# EAGLE design board (EAGLE 6.5.0)
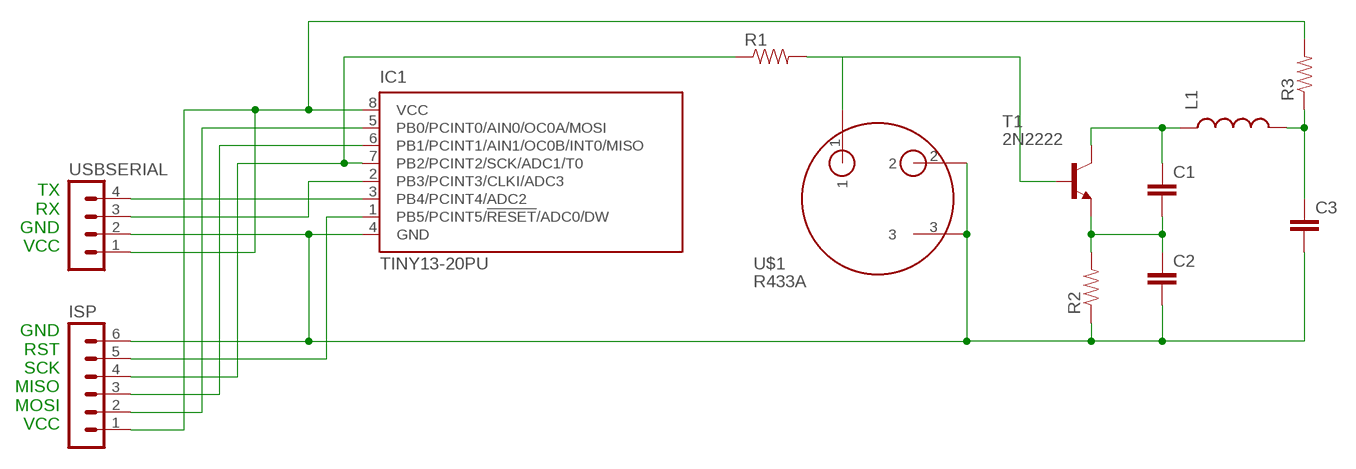
[diagram p0: schematic, sheet 1]

## Parts
C1  CAPPTH  [CAP-PTH-SMALL]
C2  CAPPTH  [CAP-PTH-SMALL]
C3  CAPPTH1  [CAP-PTH-5MM]
IC1  TINY13-20PU  [DIL08]
ISP  MA06-1  [MA06-1]
L1  INDUCTORAXIAL-0.6  [AXIAL-0.6]
R1  RESISTORAXIAL-0.3  [AXIAL-0.3]
R2  RESISTORAXIAL-0.3  [AXIAL-0.3]
R3  RESISTORAXIAL-0.3  [AXIAL-0.3]
T1  2N2222  [TO92-EBC-OVAL]
U$1  R433A  [TO-39]
USBSERIAL  MA04-1  [MA04-1]

## Nets
N$2: IC1.8(VCC) ISP.1 R3.P$2 USBSERIAL.1
N$3: IC1.2(PB3/PCINT3/CLKI/ADC3) USBSERIAL.3
N$4: IC1.3(PB4/PCINT4/ADC2) USBSERIAL.4
N$5: IC1.7(PB2/PCINT2/SCK/ADC1/T0) ISP.4 R1.P$1
N$6: R1.P$2 T1.B U$1.1
N$7: C3.1 L1.P$2 R3.P$1
N$8: C2.2 C3.2 IC1.4(GND) ISP.6 R2.P$1 U$1.2 U$1.3 USBSERIAL.2
N$9: C1.2 C2.1 R2.P$2 T1.E
N$11: C1.1 L1.P$1 T1.C
N$12: IC1.1(PB5/PCINT5/!RESET!/ADC0/DW) ISP.5
N$14: IC1.6(PB1/PCINT1/AIN1/OC0B/INT0/MISO) ISP.3
N$15: IC1.5(PB0/PCINT0/AIN0/OC0A/MOSI) ISP.2

## Notes on the sheet
- TX
  RX
  GND
  VCC
- GND
  RST
  SCK
  MISO
  MOSI
  VCC

## Library data of the parts
C1-C3 = SparkFun-Capacitors:CAP: Capacitor Standard 0603 ceramic capacitor, and 0.1" leaded capacitor.
IC1 = atmel:TINY13: 8-bit AVR Microcontroller with 1K Bytes In-System Programmable Flash Source: http://www.atmel.com/dyn/resources/prod_documents/2535S.pdf; MPN: ATTINY13-20PU; OC_FARNELL: 9171550; OC_NEWARK: 96K6521
ISP = con-lstb:MA06-1: PIN HEADER; OC_FARNELL: unknown; OC_NEWARK: unknown
L1 = SparkFun-Passives:INDUCTOR: Inductors Basic Inductor/Choke - 0603 and 1206. Footprints are not proven and vary greatly between part numbers. SRN6045- 33uH, 20% 1.4A SDR0403-560KL - 56uH, 10%, 500mA RMS/740mA peak
R1-R3 = SparkFun-Passives:RESISTOR: Resistor Basic schematic elements and footprints for 0603, 1206, and PTH resistors.
T1 = adafruit:2N2222: NPN TRANSISTOR Big oval pads
U$1 = appsome:R433A: The R433A is a true one-port, surface-acoustic-wave (SAW) resonator in a low-profile metal TO-39 case. It provides reliable, fundamental-mode, quartz frequency stabilization i.e. in transmitters or local oscillators operating at 433.920 MHz.
USBSERIAL = con-lstb:MA04-1: PIN HEADER; OC_FARNELL: unknown; OC_NEWARK: unknown

## Board
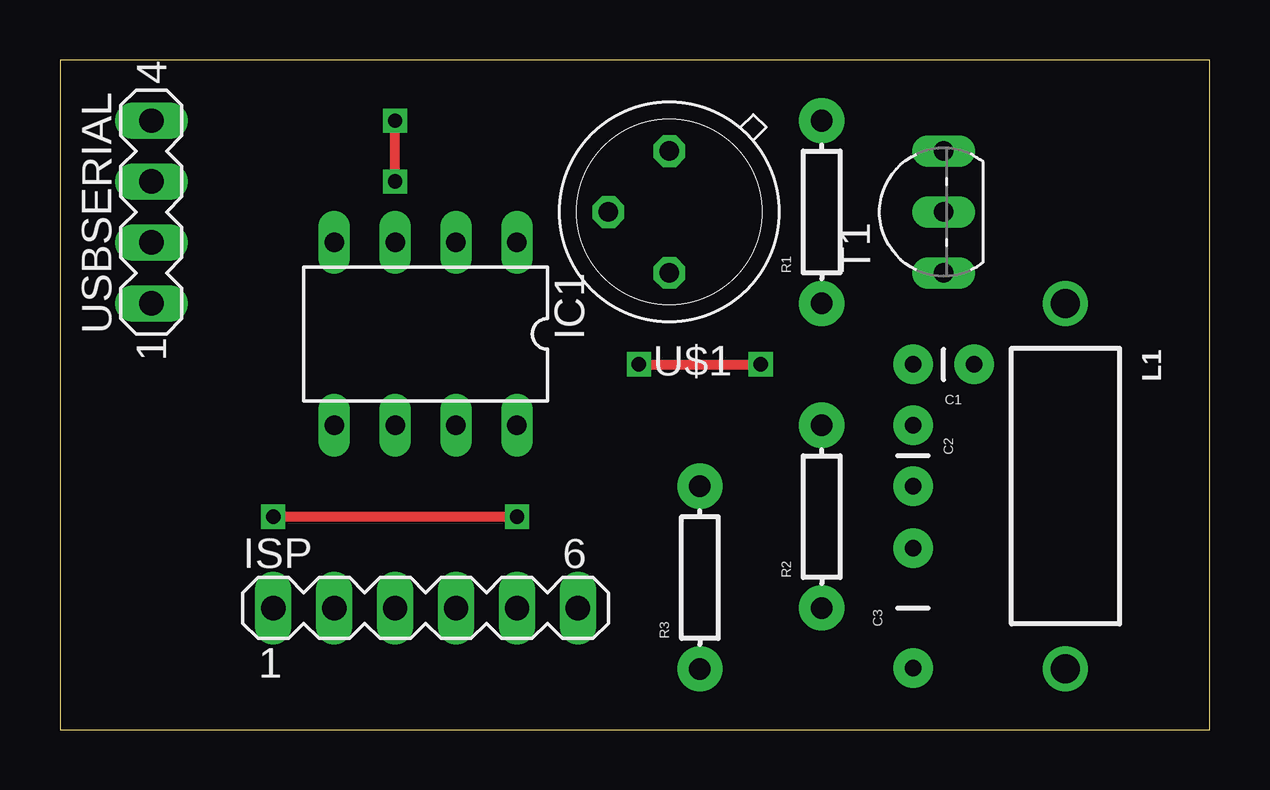
[diagram p1: board, top side]
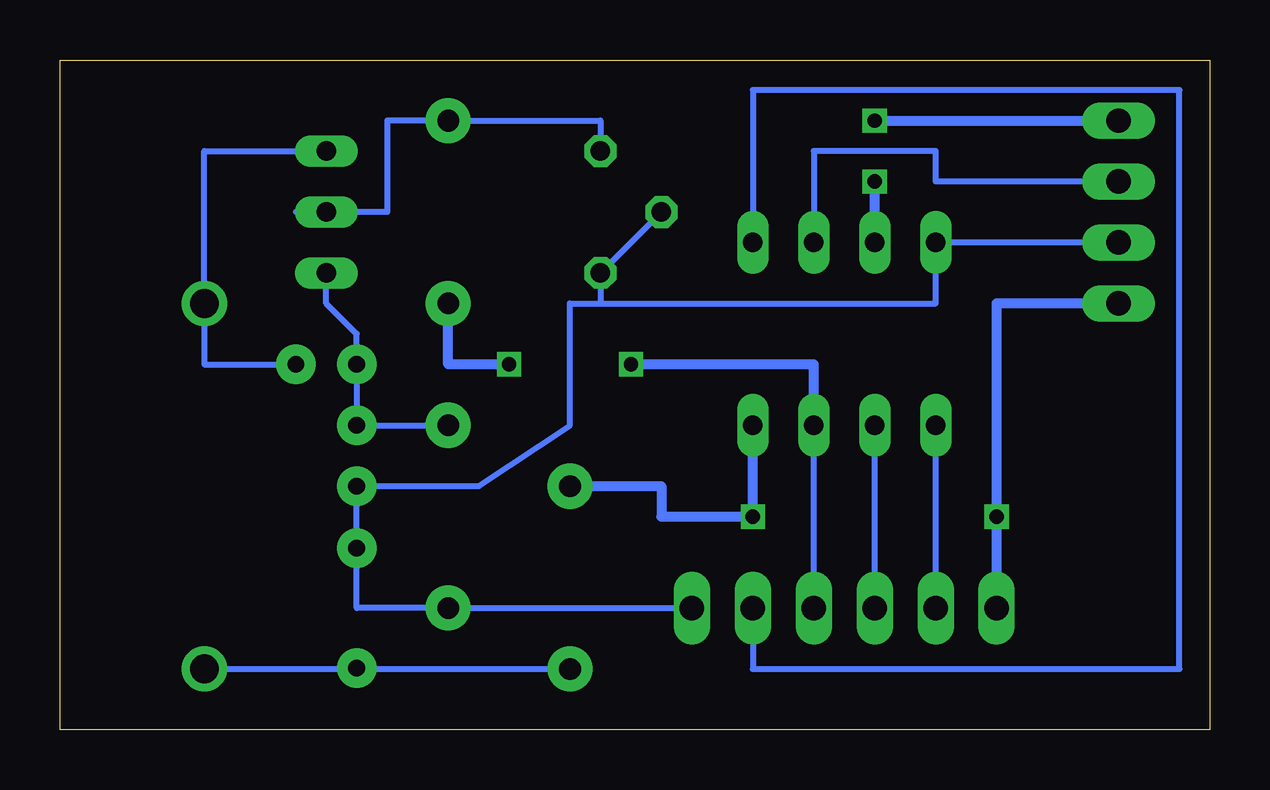
[diagram p2: board, bottom side, seen from below]

Size 47.93 x 27.93 mm. Coordinates in mm from the lower left corner, seen from the top.
Outline: 0,0 47.93,0 47.93,27.93 0,27.93 0,0
Copper layers (1*16): Top 0.035mm / dielectric 1.5mm / Bottom 0.035mm
Design rules "default": minimum track width 10mil, minimum drill 24mil, track to track 8mil, track to pad 8mil, pad to pad 8mil, via to via 8mil, smd to smd 8mil, copper to edge 40mil, drill to drill 8mil, minimum pad ring 10mil, minimum via ring 8mil, stop-mask expansion 4mil, vias tented up to drill 0mil, thermal gap 10mil

### Footprints (pad centres in the part's own frame; a part is rotated, then mirrored left to right if it is on the bottom)
CAP-PTH-SMALL = drill 0.7 pad 1.651: 1 0,0; 2 2.54,0
CAP-PTH-5MM = drill 0.7 pad 1.651: 1 -2.5,0; 2 2.5,0
DIL08 = drill 0.813 long: 1 -3.81,-3.81; 2 -1.27,-3.81; 3 1.27,-3.81; 4 3.81,-3.81; 5 3.81,3.81; 6 1.27,3.81; 7 -1.27,3.81; 8 -3.81,3.81
MA06-1 = drill 1.016 long: 1 -6.35,0; 2 -3.81,0; 3 -1.27,0; 4 1.27,0; 5 3.81,0; 6 6.35,0
AXIAL-0.6 = drill 1.2 pad 1.88: P$1 -7.62,0; P$2 7.62,0
AXIAL-0.3 = drill 0.9 pad 1.88: P$1 -3.81,0; P$2 3.81,0
TO92-EBC-OVAL = drill 0.813 long: B 0,-1.27; C 2.54,-1.27; E -2.54,-1.27
TO-39 = drill 0.813 octagon: 1 0,-2.54; 2 2.54,0; 3 0,2.54
MA04-1 = drill 1.016 long: 1 -3.81,0; 2 -1.27,0; 3 1.27,0; 4 3.81,0

### Placement (x,y rotation side)
C1  38.1,15.24 180 top
C2  35.56,12.7 270 top
C3  35.56,5.08 90 top
IC1  15.24,16.51 180 top
ISP  15.24,5.08 0 top
L1  41.91,10.16 270 top
R1  31.75,21.59 90 top
R2  31.75,8.89 90 top
R3  26.67,6.35 90 top
T1  35.56,21.59 90 top
U$1  25.4,21.59 180 top
USBSERIAL  3.81,21.59 90 top

### Tracks (layer width: path | path; a pad name or v marks a point on that pad's centre or on a via)
N$2  (via drill 0.6)
  Top 0.406: v8.89,8.89 v19.05,8.89
  Bottom 0.406: USBSERIAL.1 8.89,17.78 v8.89,8.89 ISP.1 | IC1.8 v19.05,8.89 22.86,8.89 22.86,10.16 R3.P$2
N$3
  Bottom 0.254: IC1.2 16.51,24.13 11.43,24.13 11.43,22.86 USBSERIAL.3
N$4  (via drill 0.6)
  Top 0.406: v13.97,22.86 v13.97,25.4
  Bottom 0.406: IC1.3 v13.97,22.86 | v13.97,25.4 USBSERIAL.4
N$5  (via drill 0.6)
  Top 0.406: v24.13,15.24 v29.21,15.24
  Bottom 0.254: ISP.4 IC1.7
  Bottom 0.406: IC1.7 16.51,15.24 v24.13,15.24 | v29.21,15.24 31.75,15.24 R1.P$1
N$6
  Bottom 0.254: 38.1,21.59 T1.B 34.29,21.59 34.29,25.4 R1.P$2 25.4,25.4 U$1.1
N$7
  Bottom 0.254: L1.P$2 35.56,2.54 | 35.56,2.54 R3.P$1 | 35.56,2.54 C3.1
N$8
  Bottom 0.254: USBSERIAL.2 IC1.4 11.43,17.78 25.4,17.78 | U$1.2 U$1.3 25.4,17.78 | ISP.6 R2.P$1 35.56,5.08 C3.2 C2.2 30.48,10.16 26.67,12.7 26.67,17.78 25.4,17.78
N$9
  Bottom 0.254: T1.E 36.83,17.78 35.56,16.51 C1.2 C2.1 R2.P$2
N$11
  Bottom 0.254: T1.C 41.91,24.13 L1.P$1 41.91,15.24 C1.1
N$12
  Bottom 0.254: IC1.1 19.05,26.67 1.27,26.67 1.27,2.54 19.05,2.54 ISP.5
N$14
  Bottom 0.254: ISP.3 IC1.6
N$15
  Bottom 0.254: ISP.2 IC1.5